# EAGLE design HeadphoneMixer (EAGLE 7.5.0)
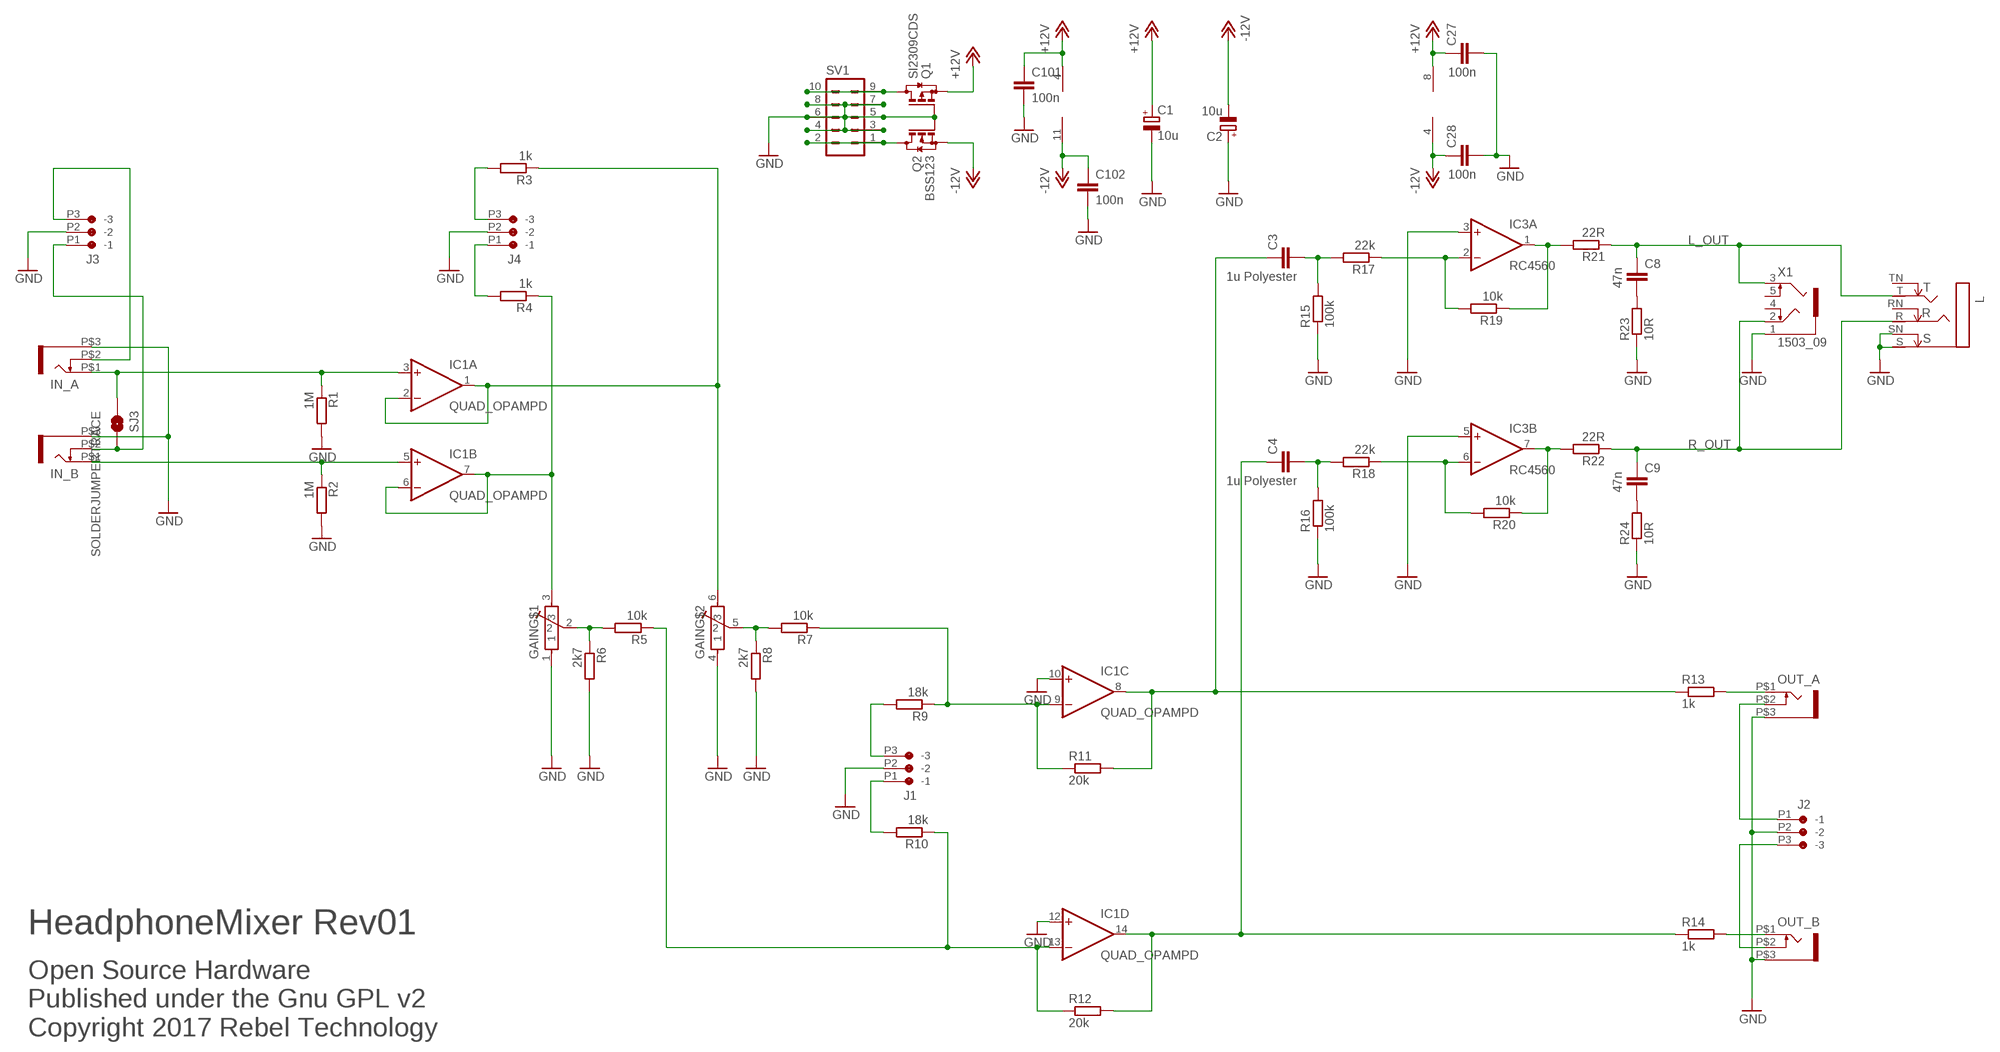
[diagram p0: schematic, sheet 1]

## Parts
C1  10u  CPOL-EU153CLV-0505  [153CLV-0505]
C2  10u  CPOL-EU153CLV-0505  [153CLV-0505]
C3  1u Polyester  C-EUC1210  [C1210]
C4  1u Polyester  C-EUC1210  [C1210]
C8  47n  C-EUC0603  [C0603]
C9  47n  C-EUC0603  [C0603]
C27  100n  C-EUC0603  [C0603]
C28  100n  C-EUC0603  [C0603]
C101  100n  C-EUC0603  [C0603]
C102  100n  C-EUC0603  [C0603]
GAIN  POT-BOURNS-PTD902  [POT-BOURNS-PTD902]
IC1  QUAD_OPAMPD  [SO14]
IC3  RC4560  NE5532D  [SO08]
IN_A  JACK-UJ-3502-R  [UJ-3502-R]
IN_B  JACK-UJ-3502-R  [UJ-3502-R]
J1  CON-JST_PH_3W  [CON-JST_PH_3W]
J2  CON-JST_PH_3W  [CON-JST_PH_3W]
J3  CON-JST_PH_3W  [CON-JST_PH_3W]
J4  CON-JST_PH_3W  [CON-JST_PH_3W]
L  NEUTRIK_NMJ6HCD2  [NMJ6HCD2]
OUT_A  JACK-UJ-3502-R  [UJ-3502-R]
OUT_B  JACK-UJ-3502-R  [UJ-3502-R]
Q1  SI2309CDS  BSS84  [SOT23]
Q2  BSS123  [SOT23]
R1  1M  R-EU_0603  [0603]
R2  1M  R-EU_0603  [0603]
R3  1k  R-EU_0603  [0603]
R4  1k  R-EU_0603  [0603]
R5  10k  R-EU_0603  [0603]
R6  2k7  R-EU_0603  [0603]
R7  10k  R-EU_0603  [0603]
R8  2k7  R-EU_0603  [0603]
R9  18k  R-EU_0603  [0603]
R10  18k  R-EU_0603  [0603]
R11  20k  R-EU_0603  [0603]
R12  20k  R-EU_0603  [0603]
R13  1k  R-EU_0603  [0603]
R14  1k  R-EU_0603  [0603]
R15  100k  R-EU_0603  [0603]
R16  100k  R-EU_0603  [0603]
R17  22k  R-EU_0603  [0603]
R18  22k  R-EU_0603  [0603]
R19  10k  R-EU_0603  [0603]
R20  10k  R-EU_0603  [0603]
R21  22R  R-EU_0603  [0603]
R22  22R  R-EU_0603  [0603]
R23  10R  R-EU_0603  [0603]
R24  10R  R-EU_0603  [0603]
SJ3  SOLDERJUMPERTRACE  [SJ_2S-TRACE]
SV1  MA05-2  [MA05-2]
X1  1503_09  [1503_09]

## Nets
+12V: C1.+ C27.1 C101.1 IC1.4(P:V+) IC3.8(P:V+) Q1.2(S)
-12V: C2.- C28.1 C102.1 IC1.11(P:V-) IC3.4(P:V-) Q2.2(S)
GND: C1.- C2.+ C27.2 C28.2 C101.2 C102.2 GAIN.1 GAIN.4 IC1.10(C:+IN) IC1.12(D:+IN) IC3.3(A:+IN) IC3.5(B:+IN) IN_A.P$3(SLEEVE) IN_B.P$3(SLEEVE) J1.P2(-2) J2.P2(-2) J3.P2(-2) J4.P2(-2) L.S L.SN OUT_A.P$3(SLEEVE) OUT_B.P$3(SLEEVE) Q1.1(G) Q2.1(G) R1.2 R2.2 R6.2 R8.2 R15.1 R16.1 R23.1 R24.1 SV1.3 SV1.4 SV1.5 SV1.6 SV1.7 SV1.8 X1.1
IN_1: IC1.5(B:+IN) IN_B.P$1(TIP) R2.1
IN_2: IC1.3(A:+IN) IN_A.P$1(TIP) R1.1 SJ3.1
IN_A: J1.P3(-3) R9.2
IN_A1: IN_A.P$2(SW) J3.P3(-3)
IN_A2: J4.P3(-3) R3.2
IN_B: J1.P1(-1) R10.2
IN_B1: IN_B.P$2(SW) J3.P1(-1) SJ3.2
IN_B2: J4.P1(-1) R4.2
L_OUT: C8.1 L.T R21.1 X1.3
N$1: Q2.3(D) SV1.1 SV1.2
N$2: IC3.7(B:OUT) R20.1 R22.2
N$3: IC3.2(A:-IN) R17.1 R19.2
N$4: C4.2 R16.2 R18.2
N$7: C4.1 IC1.14(D:OUT) R12.2 R14.1
N$8: C3.2 R15.2 R17.2
N$9: OUT_A.P$1(TIP) R13.2
N$10: C3.1 IC1.8(C:OUT) R11.2 R13.1
N$11: GAIN.3 IC1.6(B:-IN) IC1.7(B:OUT) R4.1
N$12: C9.2 R24.2
N$13: GAIN.6 IC1.1(A:OUT) IC1.2(A:-IN) R3.1
N$14: Q1.3(D) SV1.9 SV1.10
N$15: OUT_B.P$1(TIP) R14.2
N$16: IC3.6(B:-IN) R18.1 R20.2
N$19: IC3.1(A:OUT) R19.1 R21.2
N$21: C8.2 R23.2
N$29: GAIN.2 R5.2 R6.1
N$45: IC1.13(D:-IN) R5.1 R10.1 R12.1
N$50: IC1.9(C:-IN) R7.1 R9.1 R11.1
N$51: GAIN.5 R7.2 R8.1
OUT_SW_A: J2.P1(-1) OUT_A.P$2(SW)
OUT_SW_B: J2.P3(-3) OUT_B.P$2(SW)
R_OUT: C9.1 L.R R22.1 X1.2
Unconnected: L.RN L.TN X1.4 X1.5

## Notes on the sheet
- HeadphoneMixer Rev01
- Open Source Hardware
  Published under the Gnu GPL v2
  Copyright 2017 Rebel Technology

## Library data of the parts
C1 C2 = rcl:CPOL-EU: POLARIZED CAPACITOR, European symbol
C3 C4 C8 C9 C27 C28 C101 C102 = Rebel:C-EU: CAPACITOR, European symbol
GAIN = Rebel:POT-BOURNS-PTD902
IC1 = adafruit:QUAD_OPAMP: OP AMP Standard quad package
IC3 = linear:NE5532: AUDIO AMPLIFIER
IN_A IN_B OUT_A OUT_B = Rebel:JACK-UJ-3502-R
J1-J4 = Rebel:CON-JST_PH_3W
L = neutrik_jacks:NEUTRIK_NMJ6HCD2
Q1 = transistor-small-signal:BSS84: P-CHANNEL MOS FET
Q2 = transistor-small-signal:BSS123: N-CHANNEL MOS FET
R1-R24 = Rebel:R-EU_: RESISTOR, European symbol
SJ3 = SparkFun:SOLDERJUMPER: Solder Jumper Standard SMD solder jumper. Used to automate production. Two varients : Normally Open and Normally Closed are the same, but have different paste layers. NC will have a large amount of paste and should jumper during reflow.
SV1 = con-lstb:MA05-2: PIN HEADER; OC_FARNELL: unknown; OC_NEWARK: unknown
X1 = con-lumberg:1503_09: Jack connectors according to JISC 6560, 3.5 mm Klinkeneinbaukupplung nach JISC 6560, 3,5 mm, 3-polig/ stereo, abgewinkelte Ausführung, mit 2 Öffnern und Lötaugen, für Leiterplatten Rückseitenmontage Source: http://www.lumberg.com/Produkte/PDFs/1503_09.pdf; OC_FARNELL: 1243244; OC_NEWARK: unknown

## Board
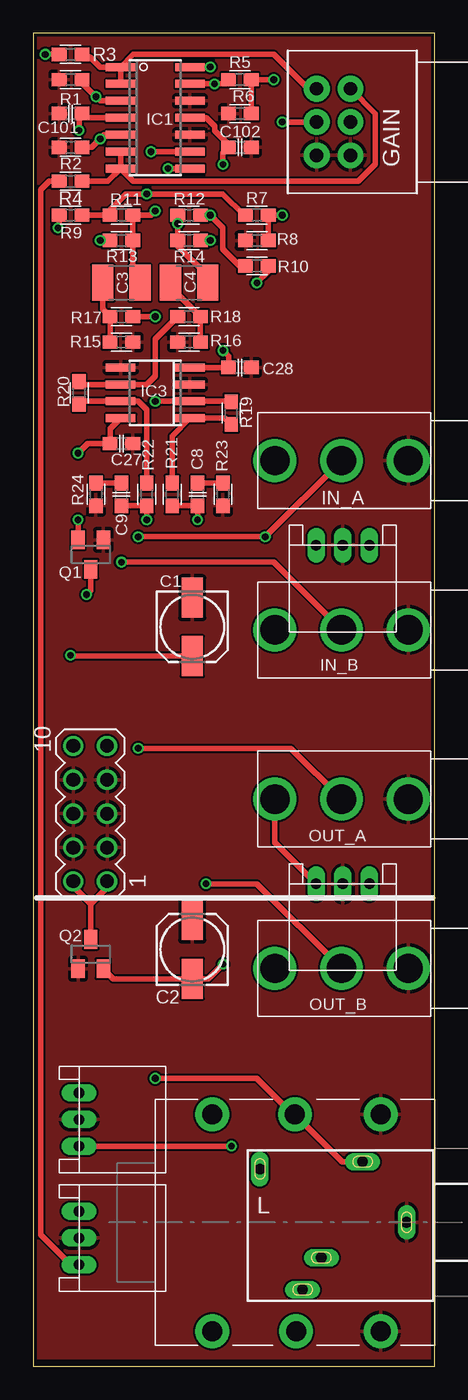
[diagram p1: board, top side]
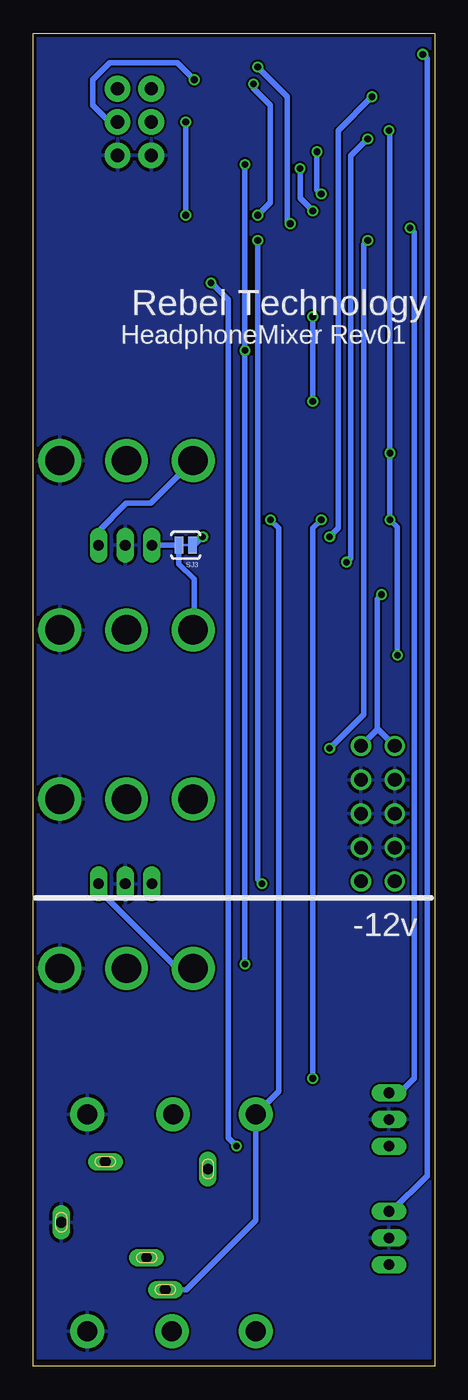
[diagram p2: board, bottom side, seen from below]

Size 30.1 x 100 mm. Coordinates in mm from the lower left corner, seen from the top.
Outline: 30.1,0 30.1,100 0,100 0,0 30.1,0
Copper layers (1*16): Top 0.035mm / dielectric 1.5mm / Bottom 0.035mm
Design rules "SeeedStudio_2layer_DRU_no_angle_20140221": minimum track width 6mil, minimum drill 12mil, track to track 6mil, track to pad 6mil, pad to pad 6mil, via to via 6mil, smd to smd 0mil, copper to edge 10mil, drill to drill 10mil, minimum pad ring 10mil, minimum via ring 6mil, stop-mask expansion 2mil, vias tented up to drill 100mil, thermal gap 10mil

### Footprints (pad centres in the part's own frame; a part is rotated, then mirrored left to right if it is on the bottom)
153CLV-0505 = smd 3 x 1.6: + 2.2,0; - -2.2,0
C1210 = smd 1.6 x 2.7: 1 -1.4,0; 2 1.4,0
C0603 = smd 1.1 x 1: 1 -0.85,0; 2 0.85,0
POT-BOURNS-PTD902 = drill 1 pad 1.93: 1 -2.5,-0.036; 2 0,-0.036; 3 2.5,-0.036; 4 -2.5,2.5; 5 0,2.5; 6 2.5,2.5
SO14 = smd 0.6 x 2.2: 1 -3.81,-2.6; 2 -2.54,-2.6; 3 -1.27,-2.6; 4 0,-2.6; 5 1.27,-2.6; 6 2.54,-2.6; 7 3.81,-2.6; 8 3.81,2.6; 9 2.54,2.6; 10 1.27,2.6; 11 0,2.6; 12 -1.27,2.6; 13 -2.54,2.6; 14 -3.81,2.6
SO08 = smd 0.6 x 2.2: 1 -1.905,-2.6; 2 -0.635,-2.6; 3 0.635,-2.6; 4 1.905,-2.6; 5 1.905,2.6; 6 0.635,2.6; 7 -0.635,2.6; 8 -1.905,2.6
UJ-3502-R = drill 2.2: P$1 0,0; P$2 0,5; P$3 0,-5
CON-JST_PH_3W = drill 0.8 long: P1 0,0; P2 -2,0; P3 -4,0
NMJ6HCD2 = drill 1.5 pad 2.54: R -0.318,8.096; RN -0.238,-8.176; S 6.112,8.096; SN 6.112,-8.176; T -6.509,8.096; TN -6.509,-8.176
SOT23 = smd 1 x 1.4: 1 -0.95,-1.1; 2 0.95,-1.1; 3 0,1.1
0603 = smd 1.1 x 1: 1 -0.85,0; 2 0.85,0
SJ_2S-TRACE = smd 0.635 x 1.27: 1 -0.508,0; 2 0.508,0
MA05-2 = drill 1.016: 1 -5.08,-1.27; 2 -5.08,1.27; 3 -2.54,-1.27; 4 -2.54,1.27; 5 0,-1.27; 6 0,1.27; 7 2.54,-1.27; 8 2.54,1.27; 9 5.08,-1.27; 10 5.08,1.27
1503_09 = drill 0.8 pad 1.2 long: 1 0,-2.1; 2 -4.55,-5.4; 3 5.05,-9.9; 4 -4,-13.1; 5 2.65,-8.5

### Placement (x,y rotation side)
C1  11.92,55.47 270 top
C2  11.92,31.27 90 top
C3  6.6,81.28 180 top
C4  11.68,81.28 180 top
C8  12.32,65.41 90 top
C9  6.6,65.41 90 top
C27  6.6,69.22 0 top
C28  15.49,74.93 0 top
C101  2.79,93.98 180 top
C102  15.49,91.44 0 top
GAIN  23.75,93.34 90 top
IC1  9.14,93.66 270 top
IC3  9.14,73.03 90 top
IN_A  23.11,67.94 90 top
IN_B  23.11,55.24 90 top
J1  3.43,16.51 270 top
J2  21.21,36.2 180 top
J3  21.21,61.59 180 top
J4  3.43,7.62 270 top
L  19.94,10.79 0 top
OUT_A  23.11,42.55 90 top
OUT_B  23.11,29.84 90 top
Q1  4.3,60.9 180 top
Q2  4.3,30.93 0 top
R1  2.79,96.52 180 top
R2  2.79,91.44 180 top
R3  2.79,98.42 180 top
R4  2.79,88.9 180 top
R5  15.49,96.52 0 top
R6  15.49,93.98 180 top
R7  16.76,86.36 0 top
R8  16.76,84.45 180 top
R9  2.79,86.36 180 top
R10  16.76,82.55 0 top
R11  6.6,86.36 0 top
R12  11.68,86.36 180 top
R13  6.6,84.45 180 top
R14  11.68,84.45 0 top
R15  6.6,76.83 180 top
R16  11.68,76.83 0 top
R17  6.6,78.74 180 top
R18  11.68,78.74 0 top
R19  14.84,71.5 90 top
R20  3.43,73.03 90 top
R21  10.41,65.41 90 top
R22  8.51,65.41 90 top
R23  14.22,65.41 90 top
R24  4.7,65.41 90 top
SJ3  18.67,61.59 180 bottom
SV1  4.26,41.45 90 top
X1  30.1,10.79 270 top

### Tracks (layer width: path | path; a pad name or v marks a point on that pad's centre or on a via)
+12V  (via drill 0.5)
  Top 0.406: Q1.2 v3.35,63.5 | IC3.8 5.75,70.33 C27.1 4.06,69.22 v3.35,68.5 | v3.43,92.71 3.43,93.77 C101.1 3.96,93.66 IC1.4 | C1.+ 2.87,53.27 v2.79,53.34
  Bottom 0.406: v3.43,92.71 3.35,92.64 v3.35,68.5 v3.35,63.5 2.79,62.94 v2.79,53.34
-12V  (via drill 0.5)
  Top 0.406: v14.22,30.16 13.14,29.07 C2.- 6,29.07 Q2.2 | IC1.11 12.95,93.66 13.59,93.03 13.59,92.71 14.64,91.66 C102.1 14.22,91.02 v14.22,90.17 | IC3.4 C28.1 14.64,75.78 v14.22,76.2
  Bottom 0.406: v14.22,30.16 v14.22,76.2 v14.22,90.17
GND
  pour Bottom: -7.37,0.64 37.08,0.64 37.08,100.97 -7.37,100.97
  pour Top: -6.1,0.64 38.35,0.64 38.35,100.97 -6.1,100.97
IN_1  (via drill 0.5)
  Top 0.406: R2.1 4.38,91.44 v5.02,92.08 5.33,92.39 IC1.5 | IN_B.P$1 18.03,60.33 v6.6,60.33
  Bottom 0.406: v6.6,60.33 6.29,60.64 6.29,90.81 v5.02,92.08
IN_2  (via drill 0.5)
  Top 0.406: R1.1 3.64,96.31 v4.7,95.25 5.02,94.93 IC1.3 | IN_A.P$1 v17.4,62.23 v7.87,62.23
  Bottom 0.406: v7.87,62.23 7.24,62.87 7.24,92.71 v4.7,95.25 | SJ3.1 18.03,61.59 v17.4,62.23
IN_A  (via drill 0.5)
  Top 0.406: R9.2 1.94,85.51 v1.84,85.41
  Bottom 0.406: J1.P3 2.6,20.51 1.52,21.59 1.52,85.09 v1.84,85.41
IN_A1
  Bottom 0.406: J3.P3 25.21,62.67 23.11,64.77 21.29,64.77 IN_A.P$2
IN_A2  (via drill 0.5)
  Top 0.406: v0.89,98.42 R3.2
  Bottom 0.406: J4.P3 3.24,11.62 0.57,14.29 0.57,98.11 v0.89,98.42
IN_B  (via drill 0.5)
  Top 0.406: R10.2 17.61,82.13 v16.76,81.28 | v14.86,16.51 J1.P1
  Bottom 0.406: v16.76,81.28 15.49,80.01 15.49,17.14 v14.86,16.51
IN_B1
  Bottom 0.406: J3.P1 SJ3.2 19.18,60.2 18.03,59.05 18.03,55.33 IN_B.P$2
IN_B2
  Top 0.406: J4.P1 2.79,7.62 0.57,9.84 0.57,88.27 1.21,88.9 R4.2
L_OUT  (via drill 0.5)
  Top 0.406: R21.1 C8.1 v12.32,63.5
  Bottom 0.406: v12.32,63.5 11.68,62.87 11.68,20.64 L.T 13.43,10.95 18.64,5.75 X1.3
N$1
  Top 0.406: SV1.2 2.99,35.99 4.3,34.69 | Q2.3 4.3,34.69 | SV1.1 5.53,35.91 4.3,34.69
N$2
  Top 0.406: R20.1 3.64,72.39 IC3.7 7.87,72.39 8.51,71.75 R22.2
N$3  (via drill 0.5)
  Top 0.406: R17.1 v9.14,78.74 | v9.14,72.39 IC3.2 14.8,72.39 R19.2
  Bottom 0.406: v9.14,78.74 v9.14,72.39
N$4
  Top 0.406: R16.2 R18.2 10.28,80.99 C4.2
N$7  (via drill 0.5)
  Top 0.406: R12.2 v10.83,85.72 R14.1 10.83,84.03 12.95,81.92 12.95,81.41 C4.1 | IC1.14 v13.27,97.47
  Bottom 0.406: v13.27,97.47 11.05,95.25 11.05,85.94 v10.83,85.72
N$8
  Top 0.406: R15.2 R17.2 5.2,79.29 C3.2
N$9  (via drill 0.5)
  Top 0.406: OUT_A.P$1 19.3,46.35 v7.87,46.35 | v5.02,84.45 R13.2
  Bottom 0.406: v7.87,46.35 5.33,48.9 5.33,84.14 v5.02,84.45
N$10  (via drill 0.5)
  Top 0.406: IC1.8 v10.1,89.85 | v9.14,86.68 8.83,86.36 R11.2 R13.1 7.45,81.83 C3.1
  Bottom 0.406: v10.1,89.85 10.1,87.63 v9.14,86.68
N$11
  Top 0.406: IC1.7 IC1.6 | R4.1 5.59,88.9 IC1.7 | GAIN.3 25.65,93.98 25.65,90.17 24.38,88.9 7.5,88.9 IC1.7
N$12
  Top 0.406: C9.2 R24.2
N$13
  Top 0.406: IC1.2 IC1.1 | R3.1 4.28,98.21 5.02,97.47 IC1.1 | GAIN.6 20.61,95.84 18.03,98.42 7.5,98.42 IC1.1
N$14  (via drill 0.5)
  Top 0.406: Q1.3 4.3,58.21 v3.99,57.89
  Bottom 0.406: 3.99,57.86 v3.99,57.89 4.3,57.57 4.3,47.84 | 4.3,47.84 SV1.10 | 4.3,47.84 4.3,47.77 SV1.9
N$15  (via drill 0.5)
  Top 0.406: R14.2 v13.27,84.45 | v12.95,36.2 16.76,36.2 OUT_B.P$1
  Bottom 0.406: v13.27,84.45 13.27,36.51 v12.95,36.2
N$16
  Top 0.406: R20.2 3.64,73.66 IC3.6 8.51,73.66 9.14,74.3 9.14,77.05 R18.1
N$19
  Top 0.406: R19.1 14.37,71.12 IC3.1 10.41,69.79 R21.2
N$21
  Top 0.406: R23.2 C8.2
N$29  (via drill 0.5)
  Top 0.406: v18.03,96.52 R5.2 R6.1
  Bottom 0.406: GAIN.2 24.38,93.34 25.65,94.61 25.65,96.52 24.38,97.79 19.3,97.79 v18.03,96.52
N$45  (via drill 0.5)
  Top 0.406: R5.1 14.33,96.2 v13.59,96.2 IC1.13 | R12.1 v13.27,86.36 14.22,85.41 14.22,83.82 15.49,82.55 R10.1
  Bottom 0.406: v13.59,96.2 13.59,95.89 12.32,94.61 12.32,87.31 v13.27,86.36
N$50  (via drill 0.5)
  Top 0.406: R9.1 R11.1 5.75,86.78 6.92,87.95 v8.51,87.95 14.22,87.95 15.81,86.36 R7.1 | IC1.9 v8.83,91.12
  Bottom 0.406: v8.83,91.12 8.83,88.27 v8.51,87.95
N$51  (via drill 0.5)
  Top 0.406: GAIN.5 v18.67,93.34 | v18.67,86.36 R7.2 R8.1
  Bottom 0.406: v18.67,93.34 v18.67,86.36
OUT_SW_A
  Top 0.406: OUT_A.P$2 18.11,39.29 J2.P1
OUT_SW_B
  Bottom 0.406: J2.P3 25.21,35.75 19.3,29.84 OUT_B.P$2
R_OUT  (via drill 0.5)
  Top 0.406: C9.1 R22.1 v8.51,63.5 | X1.2 23.17,15.35 L.R 19.46,18.89 16.76,21.59 v9.14,21.59
  Bottom 0.406: v8.51,63.5 9.14,62.87 v9.14,21.59

### Text on the board
bPlace: Rebel Technology | HeadphoneMixer Rev01 | -12v